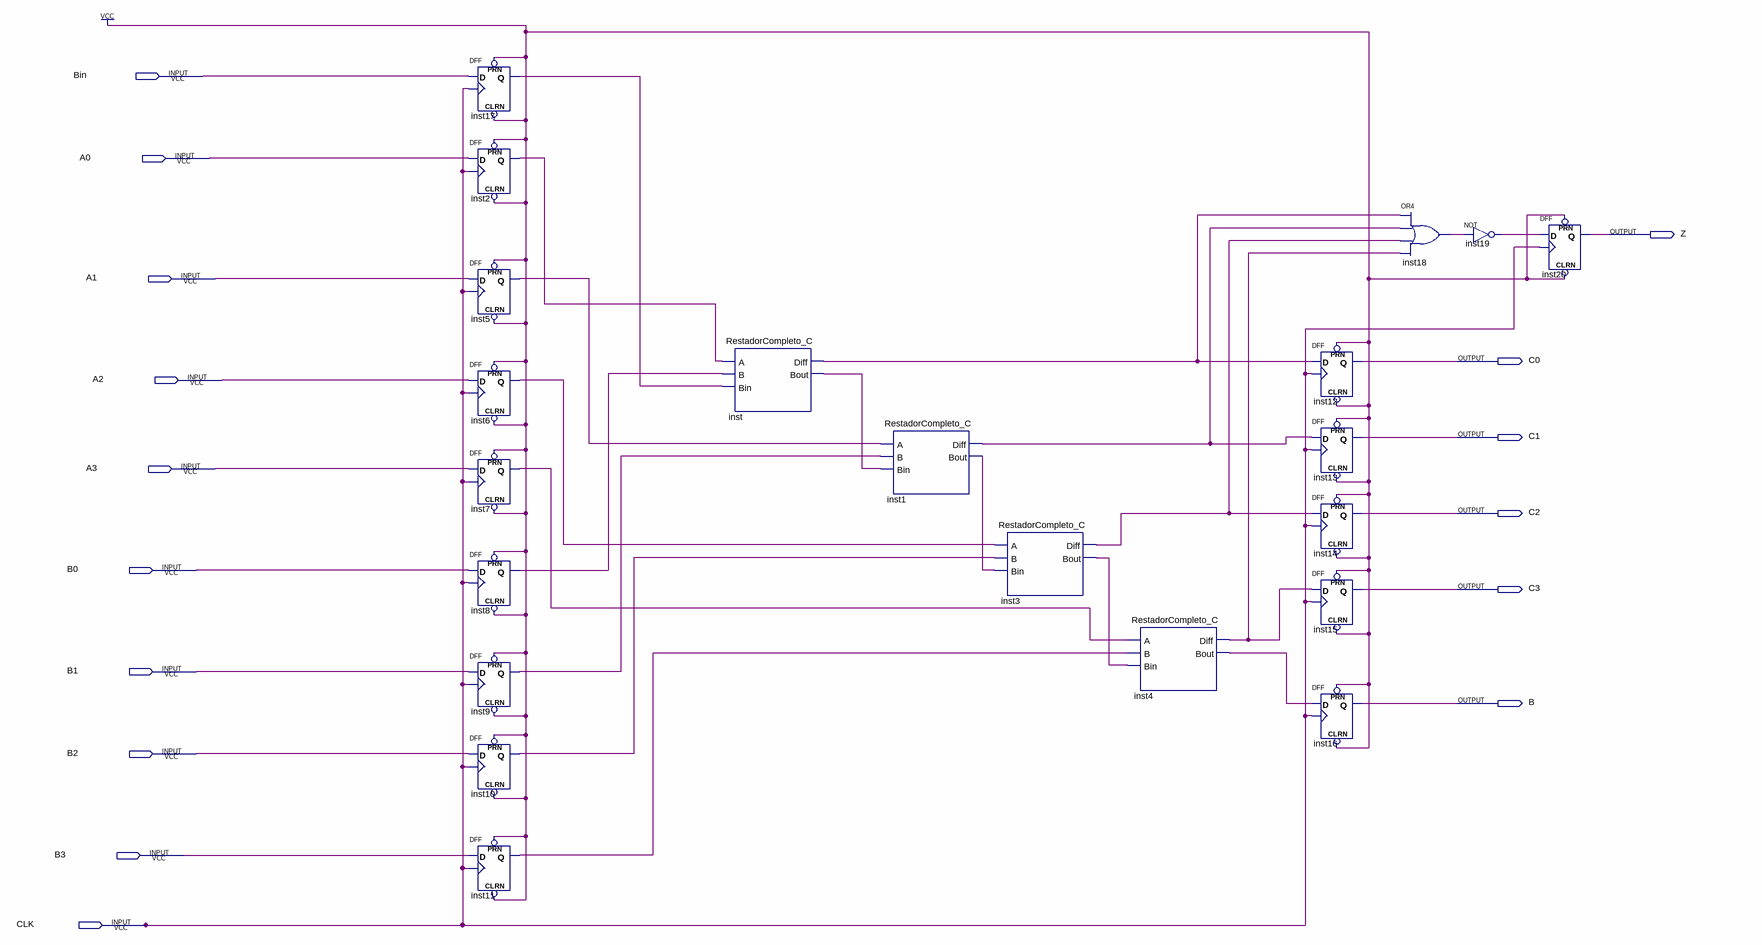
[diagram p0: schematic sheet]
// Quartus schematic PARTE_C.bdf as structural Verilog: 21 symbols, 16 pins
module PARTE_C (
  input  Bin,
  input  A0,
  input  A1,
  input  A2,
  input  A3,
  input  B0,
  input  B1,
  input  B2,
  input  B3,
  input  CLK,
  output Z,
  output C0,
  output C1,
  output C2,
  output C3,
  output B
);

  wire inst1_bout, inst1_diff, inst2_q, inst3_bout, inst3_diff, inst4_bout, inst4_diff, inst5_q, inst6_q,
       inst7_q, inst8_q, inst9_q, inst10_q, inst11_q, inst17_q, inst18_out, inst19_out, inst_bout, inst_diff;

  DFF inst17 (.CLRN(1'b1), .CLK(CLK), .D(Bin), .PRN(1'b1), .Q(inst17_q));
  DFF inst2 (.CLRN(1'b1), .CLK(CLK), .D(A0), .PRN(1'b1), .Q(inst2_q));
  DFF inst5 (.CLRN(1'b1), .CLK(CLK), .D(A1), .PRN(1'b1), .Q(inst5_q));
  DFF inst6 (.CLRN(1'b1), .CLK(CLK), .D(A2), .PRN(1'b1), .Q(inst6_q));
  DFF inst7 (.CLRN(1'b1), .CLK(CLK), .D(A3), .PRN(1'b1), .Q(inst7_q));
  DFF inst8 (.CLRN(1'b1), .CLK(CLK), .D(B0), .PRN(1'b1), .Q(inst8_q));
  DFF inst9 (.CLRN(1'b1), .CLK(CLK), .D(B1), .PRN(1'b1), .Q(inst9_q));
  DFF inst10 (.CLRN(1'b1), .CLK(CLK), .D(B2), .PRN(1'b1), .Q(inst10_q));
  DFF inst11 (.CLRN(1'b1), .CLK(CLK), .D(B3), .PRN(1'b1), .Q(inst11_q));
  RestadorCompleto_C inst (.A(inst2_q), .B(inst8_q), .Bin(inst17_q), .Diff(inst_diff), .Bout(inst_bout));
  RestadorCompleto_C inst1 (.A(inst5_q), .B(inst9_q), .Bin(inst_bout), .Diff(inst1_diff), .Bout(inst1_bout));
  RestadorCompleto_C inst3 (.A(inst6_q), .B(inst10_q), .Bin(inst1_bout), .Diff(inst3_diff), .Bout(inst3_bout));
  RestadorCompleto_C inst4 (.A(inst7_q), .B(inst11_q), .Bin(inst3_bout), .Diff(inst4_diff), .Bout(inst4_bout));
  DFF inst12 (.CLRN(1'b1), .CLK(CLK), .D(inst_diff), .PRN(1'b1), .Q(C0));
  DFF inst13 (.CLRN(1'b1), .CLK(CLK), .D(inst1_diff), .PRN(1'b1), .Q(C1));
  DFF inst14 (.CLRN(1'b1), .CLK(CLK), .D(inst3_diff), .PRN(1'b1), .Q(C2));
  DFF inst15 (.CLRN(1'b1), .CLK(CLK), .D(inst4_diff), .PRN(1'b1), .Q(C3));
  DFF inst16 (.CLRN(1'b1), .CLK(CLK), .D(inst4_bout), .PRN(1'b1), .Q(B));
  or inst18 (inst18_out, inst_diff, inst1_diff, inst3_diff, inst4_diff);
  not inst19 (inst19_out, inst18_out);
  DFF inst20 (.CLRN(1'b1), .CLK(CLK), .D(inst19_out), .PRN(1'b1), .Q(Z));
endmodule
